# Altium schematic sheet MCU.SchDoc
size A4
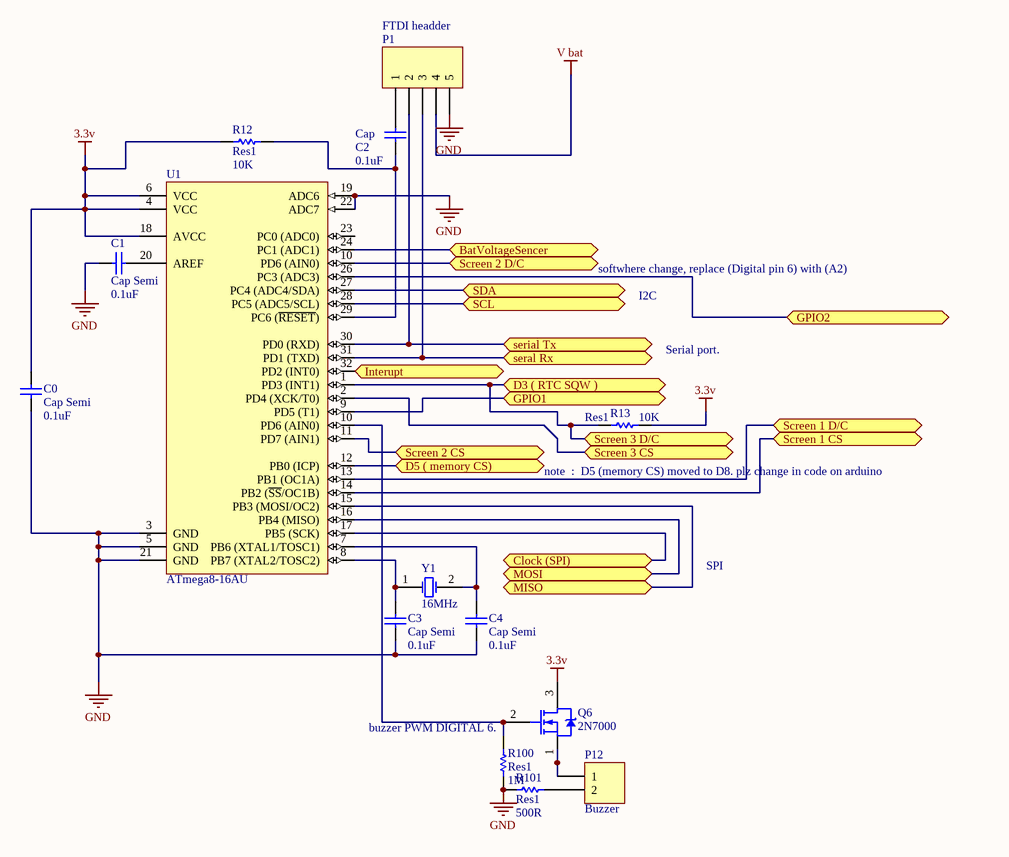
[diagram p0: MCU.SchDoc]

## Parts
C0  Cap Semi  value 0.1uF  [C1206]
C1  Cap Semi  value 0.1uF  [C1206]
C2  Cap  value 0.1uF  [J1-0603]
C3  Cap Semi  value 0.1uF  [C1206]
C4  Cap Semi  value 0.1uF  [C1206]
P1  FTDI headder  [HDR1X5]
P12  Buzzer  [HDR1X2]
Q6  2N7000  [ONSC-SOT-323-3-419-04_V]
R12  Res1  value 10K  [0402]
R13  Res1  value 10K  [0402]
R100  Res1  value 1M  [0603]
R101  Res1  value 500R  [0603]
U1  ATmega8-16AU  [32A_N]
Y1  16MHz  [R38]

## Ports
BatVoltageSencer (bidir), Clock (SPI) (bidir), D3 ( RTC SQW ) (bidir), D5 ( memory CS) (bidir), GPIO1 (bidir), GPIO2 (bidir), Interupt (bidir), MISO (bidir), MOSI (bidir), SCL (bidir), Screen 1 CS (bidir), Screen 1 D/C (bidir), Screen 2 CS (bidir), Screen 2 D/C (bidir), Screen 3 CS (bidir), Screen 3 D/C (bidir), SDA (bidir), seral Rx (bidir), serial Tx (bidir)

## Nets
3.3v: C0.2 Q6.3(D) R12.1 R13.2 U1.4(VCC) U1.6(VCC) U1.18(AVCC)
GND: C0.1 C1.1 C3.1 C4.1 P1.5 R100.2 R101.1 U1.3(GND) U1.5(GND) U1.19(ADC6) U1.21(GND) U1.22(ADC7)
V bat: P1.4
BatVoltageSencer: U1.24(PC1_(ADC1)) ; port BatVoltageSencer
Clock (SPI): U1.17(PB5_(SCK)) ; port Clock (SPI)
D3 ( RTC SQW ): R13.1 U1.1(PD3_(INT1)) ; port Screen 3 D/C, port D3 ( RTC SQW )
D5 ( memory CS): U1.12(PB0_(ICP)) ; port D5 ( memory CS)
GPIO1: U1.9(PD5_(T1)) ; port GPIO1
GPIO2: U1.26(PC3_(ADC3)) ; port GPIO2
Interupt: U1.32(PD2_(INT0)) ; port Interupt
MISO: U1.15(PB3_(MOSI/OC2)) ; port MISO
MOSI: U1.16(PB4_(MISO)) ; port MOSI
SCL: U1.28(PC5_(ADC5/SCL)) ; port SCL
Screen 1 CS: U1.14(PB2_(~{SS}/OC1B)) ; port Screen 1 CS
Screen 1 D/C: U1.13(PB1_(OC1A)) ; port Screen 1 D/C
Screen 2 CS: U1.11(PD7_(AIN1)) ; port Screen 2 CS
Screen 2 D/C: U1.10(PD6_(AIN0)) ; port Screen 2 D/C
Screen 3 CS: U1.2(PD4_(XCK/T0)) ; port Screen 3 CS
SDA: U1.27(PC4_(ADC4/SDA)) ; port SDA
seral Rx: P1.3 U1.31(PD1_(TXD)) ; port seral Rx
serial Tx: P1.2 U1.30(PD0_(RXD)) ; port serial Tx
NetC1_2: C1.2 U1.20(AREF)
NetC2_1: C2.1 P1.1
NetC2_2: C2.2 R12.2 U1.29(PC6_(~{RESET}))
NetC3_2: C3.2 U1.8(PB7_(XTAL2/TOSC2)) Y1.1(OSC1)
NetC4_2: C4.2 U1.7(PB6_(XTAL1/TOSC1)) Y1.2(OSC2)
NetP12_1: P12.1 Q6.1(S)
NetP12_2: P12.2 R101.2
NetQ6_2: Q6.2(G) R100.1 U1.10(PD6_(AIN0))

Not connected (* = marked no-connect by the designer): U1 23(PC0_(ADC0))

## Notes on the sheet
- softwhere change, replace (Digital pin 6) with (A2)
- I2C
- Serial port.
- (near R13) note  :  D5 (memory CS) moved to D8. plz change in code on arduino
- SPI
- (near R100) buzzer PWM DIGITAL 6.

## Library data of the parts
C0 C1 C3 C4 = Cap Semi: Capacitor (Semiconductor SIM Model); Published: 8-Jun-2000; LatestRevisionDate: 29-May-2009; LatestRevisionNote: IPC-7351 Footprint Added.; PackageReference: C1206; Publisher: Altium Limited; PackageDescription: Chip Capacitor
C2 = Cap: Capacitor; Published: 8-Jun-2000; LatestRevisionDate: 17-Jul-2002; LatestRevisionNote: Re-released for DXP Platform.; PackageReference: RAD-0.3; Publisher: Altium Limited; PackageDescription: Radial Cap, Thru-Hole; 2 Leads; 0.3 in Pin Spacing
P1 = Header 5: Header, 5-Pin; LatestRevisionDate: 17-Jul-2002; LatestRevisionNote: Re-released for DXP Platform.; Publisher: Altium Limited
P12 = Header 2: Header, 2-Pin; LatestRevisionDate: 17-Jul-2002; LatestRevisionNote: Re-released for DXP Platform.; Publisher: Altium Limited
Q6 = 2N7000: Small Signal MOSFET, 200 mA, 60 V, N-Channel, 3-Pin TO-92, Bulk Box; Manufacturer: On Semiconductor; Channel Polarity: N Channel; Ciss Typ (pF): 60; Configuration: Single; Coss Typ (pF): 25; Crss Typ (pF): 5; ID Max (A): 0.2; PD Max (W): 0.35; VGS Max (V): 20; VGS(th) Max (V): 3; DatasheetVersion: Rev. 8; PackageVersion: Rev. AM; PackageReference: TO-92-3-29-11_AM_SL; PackageDescription: 3-Pin Transistor Outline, Body 4.825 x 3.685 mm, Pitch 1.27 mm; Package Type: TO-92; Packing: Bulk Box; V(BR)DSS Min (V): 60; Mounting Technology: Through Hole; PartNumber: 2N7000; ComponentLink1Description: Manufacturer URL; ComponentLink1URL: http://www.onsemi.com/; ComponentLink2Description: Datasheet; ComponentLink2URL: http://www.onsemi.com/pub_link/Collateral/2N7000-D.PDF; ComponentLink3Description: Package Specification; ComponentLink3URL: http://www.onsemi.cn/pub_link/Collateral/2N6426-D.PDF
R12 R13 R100 R101 = Res1: Resistor; Published: 8-Jun-2000; LatestRevisionDate: 17-Jul-2002; LatestRevisionNote: Re-released for DXP Platform.; PackageReference: AXIAL-0.3; Publisher: Altium Limited; PackageDescription: Axial Device, Thru-Hole; 2 Leads; 0.3 in Pin Spacing
U1 = ATmega8-16AU: 8-bit AVR Microcontroller, 4.5-5.5V, 16MHz, 8KB Flash, 512 Bytes EEPROM, 1KB SRAM, 32-pin TQFP, Industrial Grade (-40°C to 85°C); DatasheetVersion: revZ, Feb-2011; PackageVersion: revC, Oct-2010; PackageReference: 32A; PackageDescription: 32-Lead, 7x7x1.0 mm Body, 0.8mm Lead Pitch, Thin Profile Plastic Quad Flat Package (TQFP); Code_JEDEC: MS-026-ABA; ComponentLink1Description: Manufacturer URL; ComponentLink1URL: http://www.atmel.com/; ComponentLink2Description: ATmega8(L); ComponentLink2URL: http://www.atmel.com/dyn/resources/prod_documents/doc2486.pdf; ComponentLink3Description: ATmega8(L) Summary; ComponentLink3URL: http://www.atmel.com/dyn/resources/prod_documents/2486S.pdf
Y1 = XTAL: Crystal Oscillator; Published: 8-Jun-2000; LatestRevisionDate: 17-Jul-2002; LatestRevisionNote: Re-released for DXP Platform.; PackageReference: R38; Publisher: Altium Limited; PackageDescription: Crystal, Thru-Hole; 2 Leads; Body 3.1 x 8.2 mm (Dia.xH)